# EAGLE design MA (EAGLE 9.4.2)
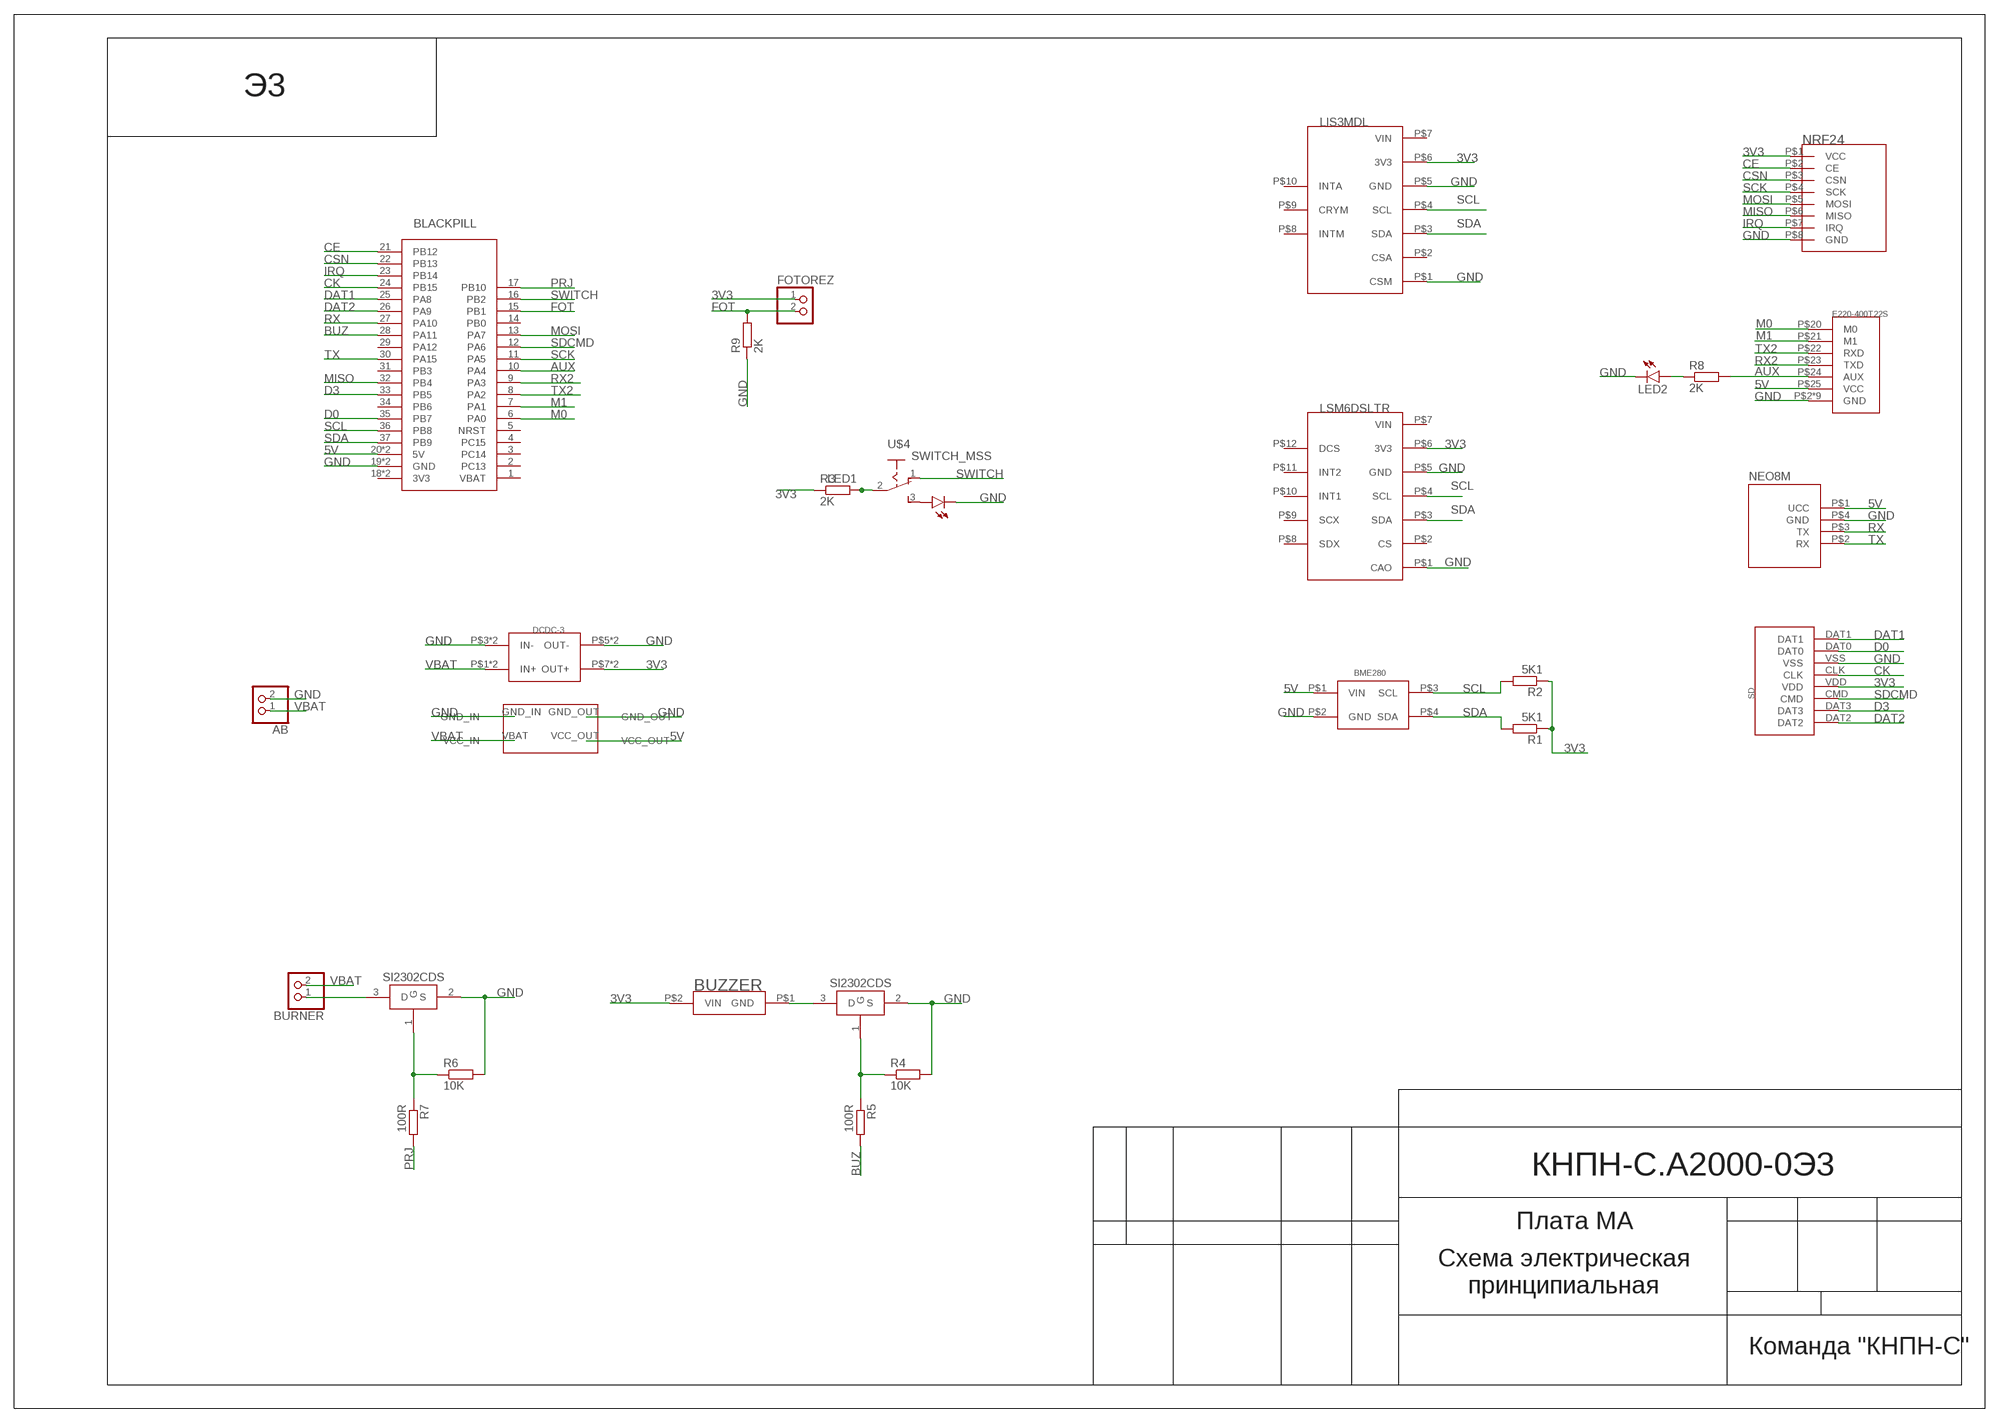
[diagram p0: schematic, sheet 1]

## Parts
AB  PINHD-1X2  [1X02]
BLACKPILL  STM32F411_BOARD  [STM32F411_BOARD]
BME280  BME280  [BME280]
BURNER  PINHD-1X2  [1X02]
BUZZER  BUZZERS8R6  [BUZZER-S8R12]
DCDC-3  MP1584-B  [MP1584-B]
E220-400T22S  E220-400T22S  [E220-400T22S]
FOTOREZ  PINHD-1X2  [1X02]
LED1  LEDCHIP-LED0603  [CHIP-LED0603]
LED2  LEDCHIP-LED0603  [CHIP-LED0603]
LIS3MDL  LIS3MDL-GY  [LIS3MDL-GY]
LSM6DSLTR  LSM6DS3-GY  [LSM6DS3-GY]
NEO8M  GPS-NEO7M  [GPS-NEO7M]
NRF24  NRF24L01_ML01SP4  [NRF24L01_ML01SP4]
R1  5K1  R-EU_R0603  [R0603]
R2  5K1  R-EU_R0603  [R0603]
R3  2K  R-EU_R0603  [R0603]
R4  10K  R-EU_R0603  [R0603]
R5  100R  R-EU_R0603  [R0603]
R6  10K  R-EU_R0603  [R0603]
R7  100R  R-EU_R0603  [R0603]
R8  2K  R-EU_R0603  [R0603]
R9  2K  R-EU_R0603  [R0603]
SD  SD  [SD]
U$1  DS-DS_5V  [DS-DS_5V]
U$2  SI2302CDS  [SOT23-3]
U$3  SI2302CDS  [SOT23-3]
U$4  SWITCH_MSS  [SWITCH_MSS]

## Nets
3V3: BUZZER.P$2(VIN) DCDC-3.P$7(OUT+) DCDC-3.P$8(OUT+) FOTOREZ.1 LIS3MDL.P$6(3V3) LSM6DSLTR.P$6(3V3) NRF24.P$1(VCC) R1.1 R2.1 R3.1 SD.VDD
5V: BLACKPILL.20(5V) BLACKPILL.38(5V) BME280.P$1(VIN) E220-400T22S.P$25(VCC) NEO8M.P$1(UCC) U$1.VCC_OUT
AUX: BLACKPILL.10(PA4) E220-400T22S.P$24(AUX) R8.2
BUZ: BLACKPILL.28(PA11) R5.2
CE: BLACKPILL.21(PB12) NRF24.P$2(CE)
CK: BLACKPILL.24(PB15) SD.CLK
CSN: BLACKPILL.22(PB13) NRF24.P$3(CSN)
D0: BLACKPILL.35(PB7) SD.DAT0
D3: BLACKPILL.33(PB5) SD.DAT3
DAT1: BLACKPILL.25(PA8) SD.DAT1
DAT2: BLACKPILL.26(PA9) SD.DAT2
FOT: BLACKPILL.15(PB1) FOTOREZ.2 R9.2
GND: AB.2 BLACKPILL.19(GND) BLACKPILL.39(GND) BME280.P$2(GND) DCDC-3.P$3(IN-) DCDC-3.P$4(IN-) DCDC-3.P$5(OUT-) DCDC-3.P$6(OUT-) E220-400T22S.P$2(GND) E220-400T22S.P$8(GND) E220-400T22S.P$11(GND) E220-400T22S.P$13(GND) E220-400T22S.P$14(GND) E220-400T22S.P$15(GND) E220-400T22S.P$16(GND) E220-400T22S.P$19(GND) E220-400T22S.P$26(GND) LED1.C LED2.C LIS3MDL.P$1(CSM) LIS3MDL.P$5(GND) LSM6DSLTR.P$1(CAO) LSM6DSLTR.P$5(GND) NEO8M.P$4(GND) NRF24.P$8(GND) R4.2 R6.2 R9.1 SD.VSS U$1.GND_IN U$1.GND_OUT U$2.2(S) U$3.2(S)
IRQ: BLACKPILL.23(PB14) NRF24.P$7(IRQ)
M0: BLACKPILL.6(PA0) E220-400T22S.P$20(M0)
M1: BLACKPILL.7(PA1) E220-400T22S.P$21(M1)
MISO: BLACKPILL.32(PB4) NRF24.P$6(MISO)
MOSI: BLACKPILL.13(PA7) NRF24.P$5(MOSI)
N$1: BUZZER.P$1(GND) U$2.3(D)
N$2: BURNER.1 U$3.3(D)
N$3: R6.1 R7.1 U$3.1(G)
N$4: R4.1 R5.1 U$2.1(G)
N$5: LED1.A U$4.3(S)
N$7: R3.2 U$4.2(P)
N$9: LED2.A R8.1
PRJ: BLACKPILL.17(PB10) R7.2
RX: BLACKPILL.27(PA10) NEO8M.P$3(TX)
RX2: BLACKPILL.9(PA3) E220-400T22S.P$23(TXD)
SCK: BLACKPILL.11(PA5) NRF24.P$4(SCK)
SCL: BLACKPILL.36(PB8) BME280.P$3(SCL) LIS3MDL.P$4(SCL) LSM6DSLTR.P$4(SCL) R2.2
SDA: BLACKPILL.37(PB9) BME280.P$4(SDA) LIS3MDL.P$3(SDA) LSM6DSLTR.P$3(SDA) R1.2
SDCMD: BLACKPILL.12(PA6) SD.CMD
SWITCH: BLACKPILL.16(PB2) U$4.1(O)
TX: BLACKPILL.30(PA15) NEO8M.P$2(RX)
TX2: BLACKPILL.8(PA2) E220-400T22S.P$22(RXD)
VBAT: AB.1 BURNER.2 DCDC-3.P$1(IN+) DCDC-3.P$2(IN+) U$1.VBAT(VCC_IN)
Unconnected: BLACKPILL.1(VBAT) BLACKPILL.2(PC13) BLACKPILL.3(PC14) BLACKPILL.4(PC15) BLACKPILL.5(NRST) BLACKPILL.14(PB0) BLACKPILL.18(3V3) BLACKPILL.29(PA12) BLACKPILL.31(PB3) BLACKPILL.34(PB6) BLACKPILL.40(3V3) LIS3MDL.P$2(CSA) LIS3MDL.P$7(VIN) LIS3MDL.P$8(INTM) LIS3MDL.P$9(CRYM) LIS3MDL.P$10(INTA) LSM6DSLTR.P$2(CS) LSM6DSLTR.P$7(VIN) LSM6DSLTR.P$8(SDX) LSM6DSLTR.P$9(SCX) LSM6DSLTR.P$10(INT1) LSM6DSLTR.P$11(INT2) LSM6DSLTR.P$12(DCS)

## Notes on the sheet
- Э3
- КНПН-С.А2000-0Э3
- Плата МА
- Схема электрическая
  принципиальная
- Команда "КНПН-С"

## Library data of the parts
AB BURNER FOTOREZ = pinhead:PINHD-1X2: PIN HEADER
BLACKPILL = MA:STM32F411_BOARD
BME280 = MA:BME280
BUZZER = MA:BUZZER
DCDC-3 = UNKNOWN-2024:MP1584-B
E220-400T22S = UNKNOWN-2024:E220-400T22S
LED1 LED2 = led:LED: LED OSRAM: - CHIPLED LG R971, LG N971, LY N971, LG Q971, LY Q971, LO R971, LY R971 LH N974, LH R974 LS Q976, LO Q976, LY Q976 LO Q996 - Hyper CHIPLED LW Q18S LB Q993, LB Q99A, LB R99A - SideLED LS A670, LO A670, LY A670, LG A670, LP A670 LB A673, LV A673, LT A673, LW A673 LH A674 LY A675 LS A676, LA A676, LO A676, LY A676, LW A676 LS A679, LY A679, LG A679 - Hyper Micro SIDELED® LS Y876, LA Y876, LO Y876, LY Y876 LT Y87S - SmartLED LW L88C, LW L88S LB L89C, LB L89S, LG L890 LS L89K, LO L89K, LY L89K LS L896, LA L896, LO L896, LY L896 - TOPLED LS T670, LO T670, LY T670, LG T670, LP T670 LSG T670, LSP T670, LSY T670, LOP T670, LYG T670 LG T671, LOG T671, LSG T671 LB T673, LV T673, LT T673, LW T673 LH T674 LS T676, LA T676, LO T676, LY T676, LB T676, LH T676, LSB T676, LW T676 LB T67C, LV T67C, LT T67C, LS T67K, LO T67K, LY T67K, LW E67C LS E67B, LA E67B, LO E67B, LY E67B, LB E67C, LV E67C, LT E67C LW T67C LS T679, LY T679, LG T679 LS T770, LO T770, LY T770, LG T770, LP T770 LB T773, LV T773, LT T773, LW T773 LH T774 LS E675, LA E675, LY E675, LS T675 LS T776, LA T776, LO T776, LY T776, LB T776 LHGB T686 LT T68C, LB T68C - Hyper Mini TOPLED® LB M676 - Mini TOPLED Santana® LG M470 LS M47K, LO M47K, LY M47K Source: http://www.osram.convergy.de LUXEON: - LUMILED® LXK2-PW12-R00, LXK2-PW12-S00, LXK2-PW14-U00, LXK2-PW14-V00 LXK2-PM12-R00, LXK2-PM12-S00, LXK2-PM14-U00 LXK2-PE12-Q00, LXK2-PE12-R00, LXK2-PE12-S00, LXK2-PE14-T00, LXK2-PE14-U00 LXK2-PB12-K00, LXK2-PB12-L00, LXK2-PB12-M00, LXK2-PB14-N00, LXK2-PB14-P00, LXK2-PB14-Q00 LXK2-PR12-L00, LXK2-PR12-M00, LXK2-PR14-Q00, LXK2-PR14-R00 LXK2-PD12-Q00, LXK2-PD12-R00, LXK2-PD12-S00 LXK2-PH12-R00, LXK2-PH12-S00 LXK2-PL12-P00, LXK2-PL12-Q00, LXK2-PL12-R00 Source: www.luxeon.com KINGBRIGHT: KA-3528ASYC Source: www.kingbright.com
LIS3MDL = MA:LIS3MDL-GY
LSM6DSLTR = MA:LSM6DS3-GY
NEO8M = MA:GPS-NEO7M
NRF24 = UNKNOWN-2024:NRF24L01_ML01SP4
R1-R9 = rcl:R-EU_: RESISTOR, European symbol; SPICEPREFIX: R
SD = UNKNOWN-2024:SD
U$1 = MA:DS-DS_5V
U$2 U$3 = CanCubeSat:SI2302CDS
U$4 = UNKNOWN-2024:SWITCH_MSS

## Board
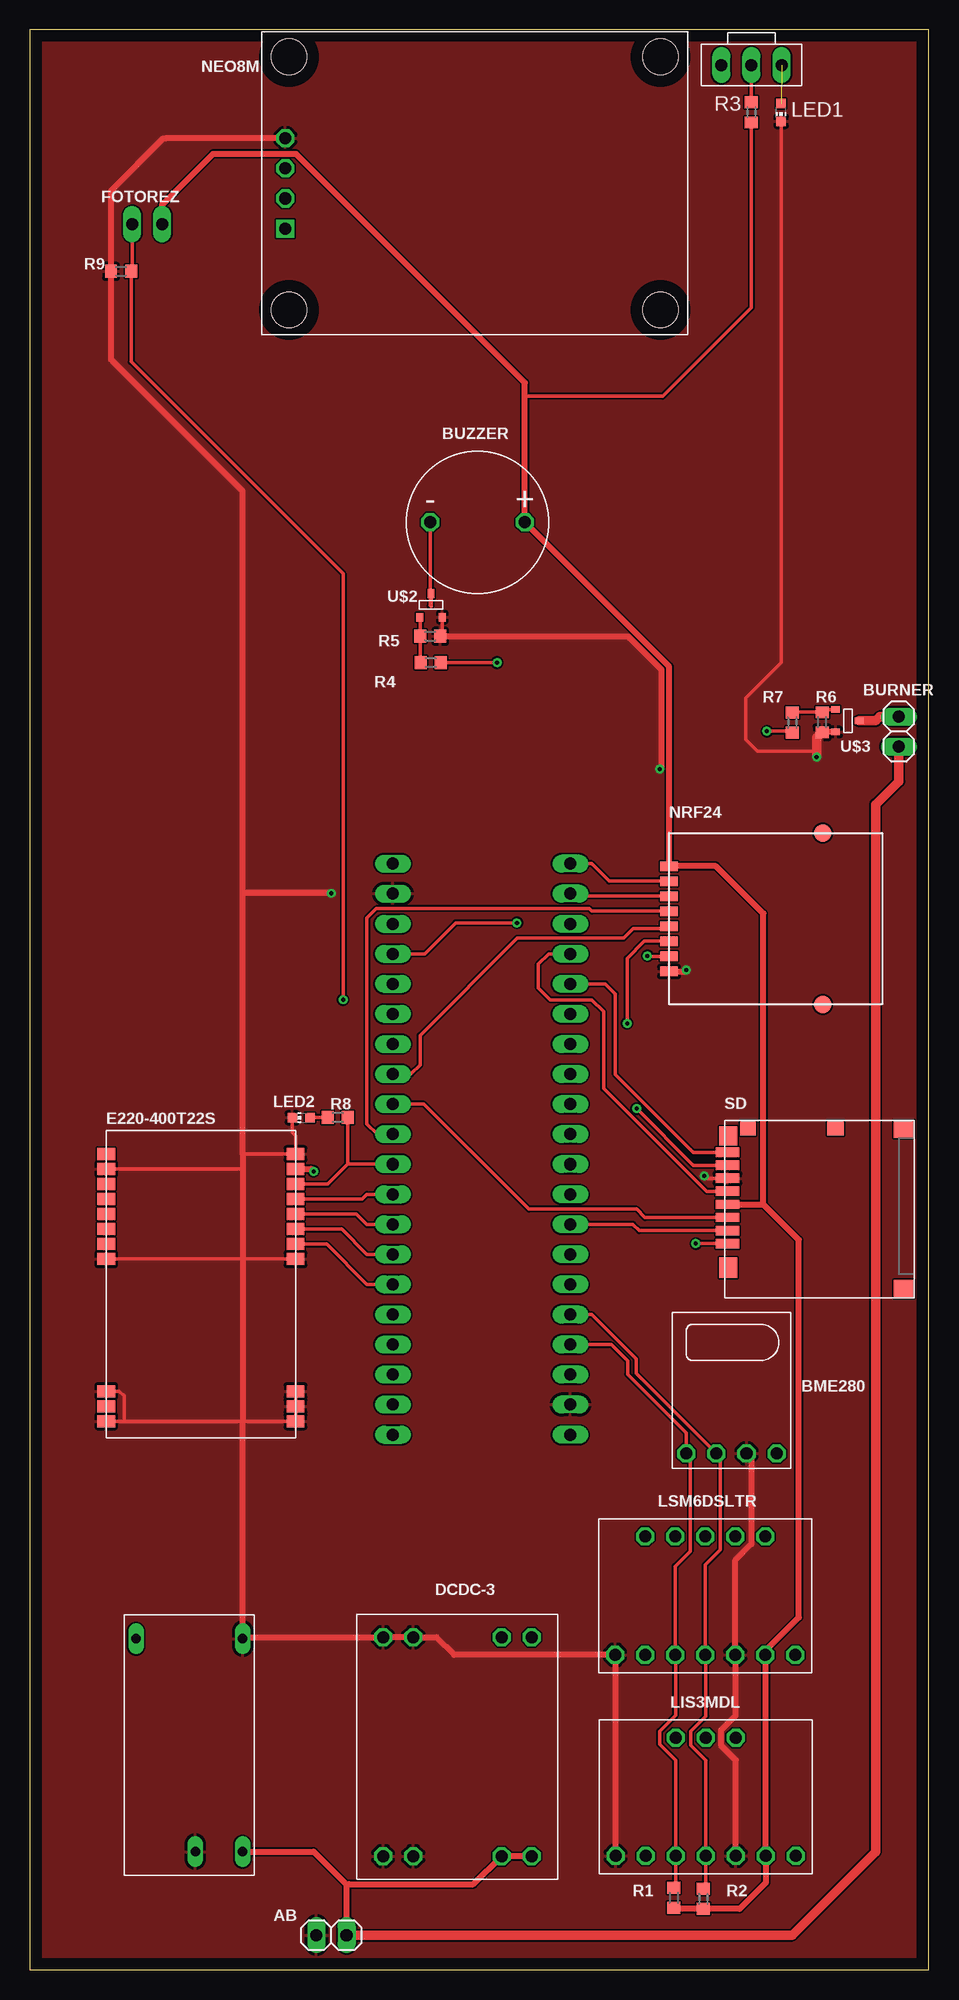
[diagram p1: board, top side]
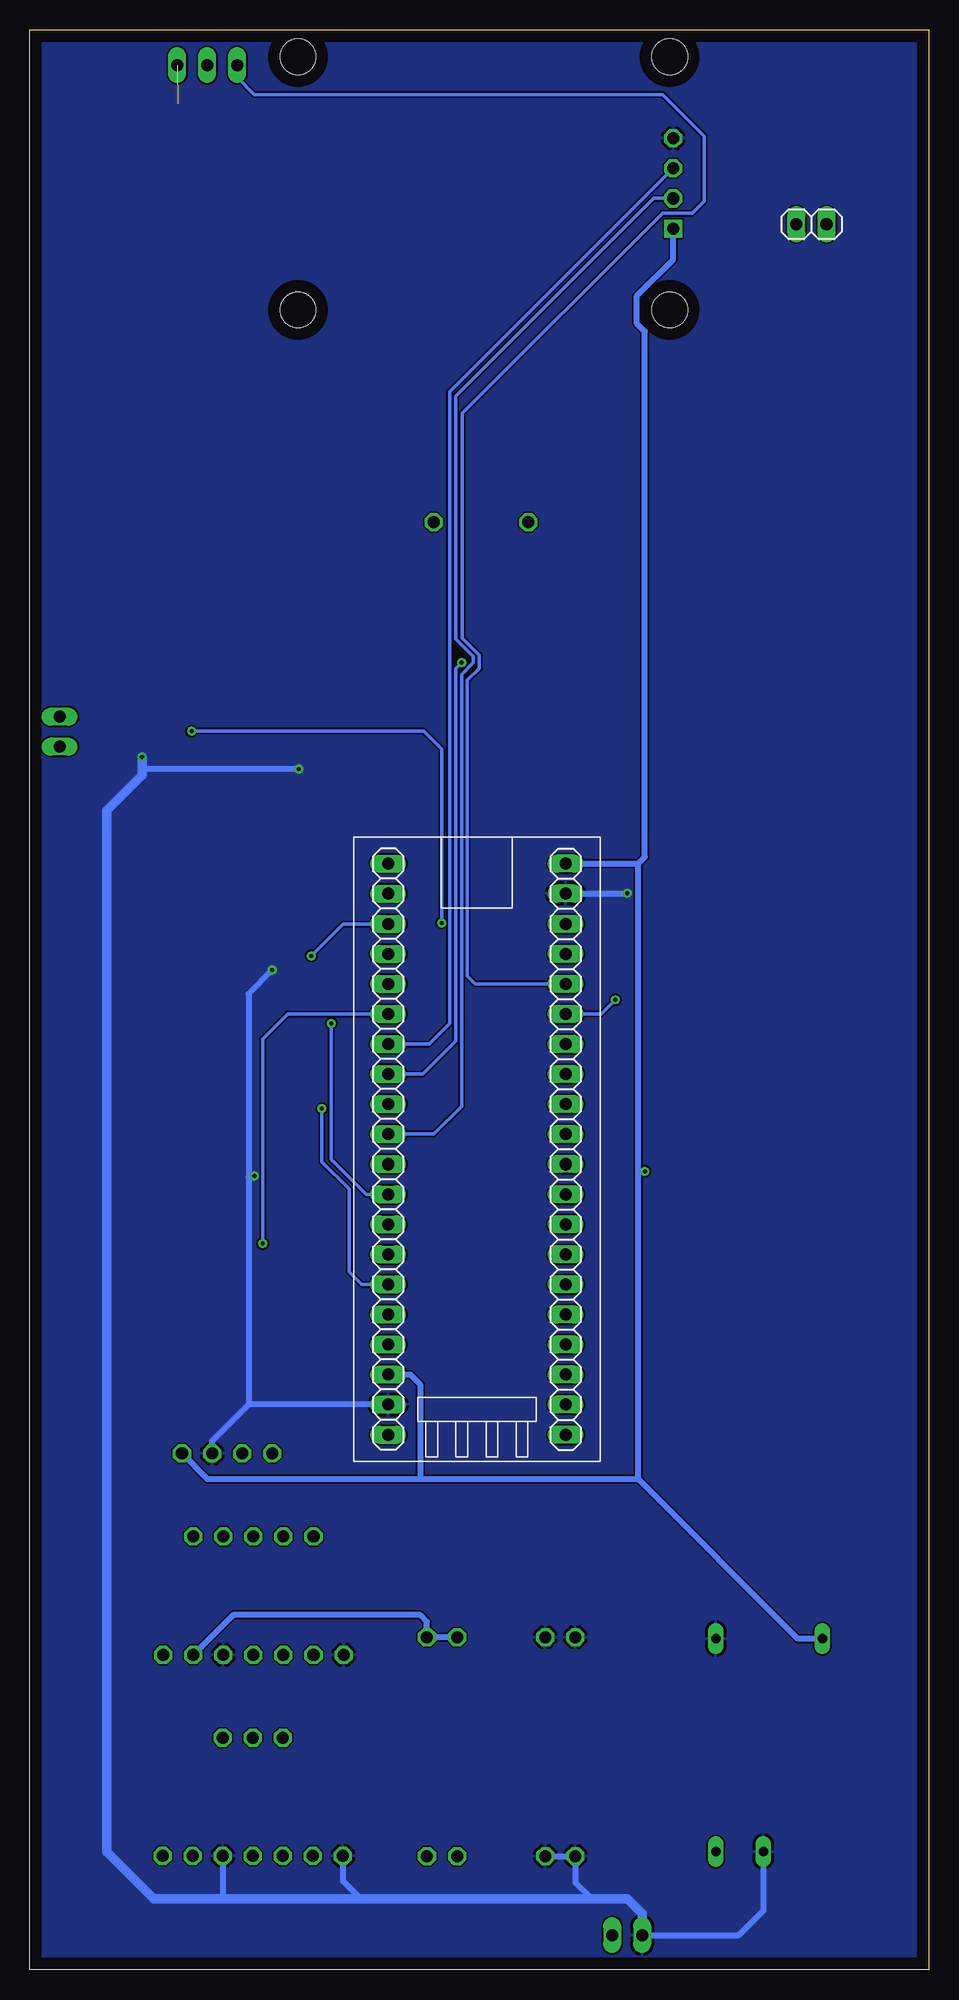
[diagram p2: board, bottom side, seen from below]

Size 76 x 164 mm. Coordinates in mm from the lower left corner, seen from the top.
Outline: 0,0 76,0 76,164 0,164 0,0
Copper layers (1*16): Top 0.035mm / dielectric 1.5mm / Bottom 0.035mm
Design rules "default": minimum track width 6mil, minimum drill 0.35mm, track to track 6mil, track to pad 6mil, pad to pad 6mil, via to via 6mil, smd to smd 6mil, copper to edge 40mil, drill to drill 6mil, minimum pad ring 10mil, minimum via ring 8mil, stop-mask expansion 4mil, vias tented up to drill 0mil, thermal gap 10mil

### Footprints (pad centres in the part's own frame; a part is rotated, then mirrored left to right if it is on the bottom)
1X02 = drill 1.016 long: 1 -1.27,0; 2 1.27,0
STM32F411_BOARD = drill 1.016 long: 1 24.13,7.5; 2 21.59,7.5; 3 19.05,7.5; 4 16.51,7.5; 5 13.97,7.5; 6 11.43,7.5; 7 8.89,7.5; 8 6.35,7.5; 9 3.81,7.5; 10 1.27,7.5; 11 -1.27,7.5; 12 -3.81,7.5; 13 -6.35,7.5; 14 -8.89,7.5; 15 -11.43,7.5; 16 -13.97,7.5; 17 -16.51,7.5; 18 -19.05,7.5; 19 -21.59,7.5; 20 -24.13,7.5; 21 -24.13,-7.5; 22 -21.59,-7.5; 23 -19.05,-7.5; 24 -16.51,-7.5; 25 -13.97,-7.5; 26 -11.43,-7.5; 27 -8.89,-7.5; 28 -6.35,-7.5; 29 -3.81,-7.5; 30 -1.27,-7.5; 31 1.27,-7.5; 32 3.81,-7.5; 33 6.35,-7.5; 34 8.89,-7.5; 35 11.43,-7.5; 36 13.97,-7.5; 37 16.51,-7.5; 38 19.05,-7.5; 39 21.59,-7.5; 40 24.13,-7.5
BME280 = drill 1.016 octagon: P$1 -3.81,5.33; P$2 -1.27,5.33; P$3 1.27,5.33; P$4 3.81,5.33
BUZZER-S8R12 = drill 1 octagon: P$1 -4,0; P$2 4,0
MP1584-B = drill 1.016 octagon: P$1 -9.25,-6.27; P$2 -9.25,-3.73; P$3 -9.25,3.73; P$4 -9.25,6.27; P$5 9.25,6.27; P$6 9.25,3.73; P$7 9.25,-3.73; P$8 9.25,-6.27
E220-400T22S = smd 1.5 x 1: P$1 -8,11; P$2 -8,9.73; P$3 -8,8.46; P$4 -8,7.19; P$5 -8,5.92; P$6 -8,4.65; P$7 -8,3.38; P$8 -8,2.11; P$11 -8,-9.06; P$12 -8,-10.33; P$13 -8,-11.6; P$14 8,-11.6; P$15 8,-10.33; P$16 8,-9.06; P$19 8,2.11; P$20 8,3.38; P$21 8,4.65; P$22 8,5.92; P$23 8,7.19; P$24 8,8.46; P$25 8,9.73; P$26 8,11
CHIP-LED0603 = smd 0.8 x 0.8: A 0,-0.75; C 0,0.75
LIS3MDL-GY = drill 1.016 octagon: P$1 -7.62,-5; P$2 -5.08,-5; P$3 -2.54,-5; P$4 0,-5; P$5 2.54,-5; P$6 5.08,-5; P$7 7.62,-5; P$8 -2.54,5; P$9 0,5; P$10 2.54,5
LSM6DS3-GY = drill 1.016 octagon: P$1 -7.62,-5; P$2 -5.08,-5; P$3 -2.54,-5; P$4 0,-5; P$5 2.54,-5; P$6 5.08,-5; P$7 7.62,-5; P$8 -5.08,5; P$9 -2.54,5; P$10 0,5; P$11 2.54,5; P$12 5.08,5
GPS-NEO7M = drill 1.016 square: P$1 -3.81,16 | drill 1.016 octagon: P$2 -1.27,16; P$3 1.27,16; P$4 3.81,16 | hole 3: -10.7,15.7; 10.7,15.7; 10.7,-15.7; -10.7,-15.7
NRF24L01_ML01SP4 = smd 1.5 x 0.8: P$1 -9,4.445; P$2 -9,3.175; P$3 -9,1.905; P$4 -9,0.635; P$5 -9,-0.635; P$6 -9,-1.905; P$7 -9,-3.175; P$8 -9,-4.445 | smd 1.5 x 1.5: P$9 4,7.25; P$10 4,-7.25
R0603 = smd 1 x 1.1: 1 -0.85,0; 2 0.85,0
SD = smd 0.8 x 2: CLK 6,-15.77; CMD 8.2,-15.77; DAT0 3.8,-15.77; DAT1 2.7,-15.77; DAT2 10.4,-15.77; DAT3 9.3,-15.77; VDD 7.1,-15.77; VSS 4.9,-15.77 | smd 1.5 x 1.7: P$9 0.75,-0.85; P$13 14.25,-0.85 | smd 1.6 x 1.5: P$10 1.3,-15.7 | smd 1.29 x 1.3: P$11 0.645,-14.05 | smd 1.29 x 1.4: P$12 0.645,-6.65 | smd 1.7 x 1.5: P$14 12.45,-15.7
DS-DS_5V = drill 0.8 long: GND_IN 0,-13; GND_OUT 4,5; VBAT 4,-13; VCC_OUT -5,5
SOT23-3 = smd 0.56 x 0.73: 1 -0.95,-1; 2 0.95,-1; 3 0,1
SWITCH_MSS = drill 1.016 long: 1 -2.54,0; 2 0,0; 3 2.54,0

### Placement (x,y rotation side)
AB  25.51,2.94 180 top
BLACKPILL  38.2,69.37 270 bottom
BME280  59.31,48.97 180 top
BURNER  73.46,104.66 270 top
BUZZER  37.85,122.36 0 top
DCDC-3  36.15,18.87 90 top
E220-400T22S  14.47,57.97 0 top
FOTOREZ  9.93,147.55 0 bottom
LED1  63.5,157 180 top
LED2  22.95,72.03 90 top
LIS3MDL  57.14,14.63 0 top
LSM6DSLTR  57.09,31.63 0 top
NEO8M  37.61,151 90 top
NRF24  63.04,88.85 0 top
R1  54.44,6.09 90 top
R2  56.94,6.01 90 top
R3  61,157 90 top
R4  33.86,112.73 0 top
R5  33.9,110.5 0 top
R6  66.96,105.45 270 top
R7  64.46,105.43 270 top
R8  26.04,72.06 0 top
R9  7.73,143.56 0 top
SD  74.74,71.8 270 top
U$1  14,23 0 top
U$2  33.92,115.33 0 top
U$3  69.1,105.59 270 top
U$4  61,161 0 top

### Tracks (layer width: path | path; a pad name or v marks a point on that pad's centre or on a via)
3V3
  Top 0.3: 57,5.16 R2.1 | LSM6DSLTR.P$6 62.22,26.58 62.22,27 | 54.52,5.16 R1.1 | 54.5,93.3 NRF24.P$1 | R3.1 61,140.5 53.5,133 41.85,133
  Top 0.5: 62.22,26.58 LIS3MDL.P$6 62.22,7.38 60,5.16 57,5.16 | 62.22,27 65,29.78 65,61.7 62,64.7 | SD.VDD 62,64.7 | 54.5,93.3 58,93.3 62,89.3 62,64.7 | R2.1 54.52,5.16 | NRF24.P$1 54.04,110.17 BUZZER.P$2 41.85,133 41.85,134.15 22.5,153.5 15.5,153.5 11.2,149.2 FOTOREZ.1
  Bottom 0.5: LSM6DSLTR.P$6 58.8,30 43,30 42.42,29.42 DCDC-3.P$8 DCDC-3.P$7
5V  (via drill 0.35)
  Top 0.5: E220-400T22S.P$25 23.8,67.7 v24,67.5
  Bottom 0.3: 24.54,41.46 24.58,41.5
  Bottom 0.5: U$1.VCC_OUT 11.08,28 24.54,41.46 | BME280.P$1 60.98,41.5 43,41.5 | 43,41.5 24.58,41.5 24.58,67.5 | v24,67.5 24.58,67.5 | 24.58,67.5 24.58,93.5 | BLACKPILL.20 24.58,93.5 | 24.58,93.5 24.01,94.07 24.01,138.49 24.68,139.15 24.68,141.5 21.61,144.57 NEO8M.P$1 | BLACKPILL.38 43.82,50.32 43,49.5 43,41.5
AUX
  Top 0.3: E220-400T22S.P$24 25.2,66.43 26.87,68.1 26.9,68.1 | R8.2 26.89,68.11 26.9,68.1 | BLACKPILL.10 26.9,68.1
BUZ  (via drill 0.35)
  Top 0.3: R5.2 v39.5,110.5
  Bottom 0.3: BLACKPILL.28 42.78,75.72 40,78.5 40,110 v39.5,110.5
CE
  Top 0.3: NRF24.P$2 48.98,92.03 47.5,93.5 BLACKPILL.21
CK
  Top 0.3: BLACKPILL.24 43.88,85.88 43,85 43,83 44,82 47.5,82 48.5,81 48.5,74.5 57.2,65.8 SD.CLK
CSN
  Top 0.3: BLACKPILL.22 45.74,91 45.98,90.75 NRF24.P$3
D0  (via drill 0.35)
  Top 0.3: SD.DAT0 56.1,68 v51.3,72.8
  Bottom 0.3: v51.3,72.8 51.3,68.3 49,66 49,59 47.94,57.94 BLACKPILL.35
D3
  Top 0.3: SD.DAT3 51.5,62.5 50.98,63.02 BLACKPILL.33
DAT1
  Top 0.3: SD.DAT1 56.1,69.1 49.5,75.7 49.5,82.5 48.66,83.34 BLACKPILL.25
DAT2  (via drill 0.35)
  Top 0.3: SD.DAT2 v56.3,61.4
  Bottom 0.3: v56.3,61.4 56.3,78.7 54.2,80.8 BLACKPILL.26
FOT  (via drill 0.35)
  Top 0.3: R9.2 8.58,143.5 | 8.58,143.5 8.58,135.92 26.5,118 v26.5,82 | FOTOREZ.2 8.66,143.58 8.58,143.5
  Bottom 0.3: v26.5,82 27.7,80.8 BLACKPILL.15
GND  (via drill 0.35)
  Top 0.3: LED2.C 22.2,70.8 22.5,70.5 22.5,69 E220-400T22S.P$26 18.03,68.97 18,69 | 11.31,154.81 11.5,154.81 | 6.88,144 R9.1 6.88,143 | 7,136 6.88,136.12 | E220-400T22S.P$13 8,46.37 | 8,46.37 17.93,46.37 | 17.93,46.37 18,46.3 | 17.93,46.37 E220-400T22S.P$14 E220-400T22S.P$15 E220-400T22S.P$16 | E220-400T22S.P$19 18.02,60.08 18,60.1 17.98,60.08 E220-400T22S.P$8 | E220-400T22S.P$2 18,67.7 | U$2.2 34.87,112.9 R4.2 | SD.VSS 57.2,66.9 v57,67.1 | 8,46.37 8,48.5 7.59,48.91 E220-400T22S.P$11 | LED1.C 63.5,110.5 60.5,107.5 60.5,104 61.5,103 66.5,103
  Top 0.5: U$3.2 67,104.64 R6.2 | LIS3MDL.P$5 59.68,17.74 58.42,19 58.42,20.27 59.63,21.48 LSM6DSLTR.P$5 59.63,34.64 60.99,36 60.99,43.23 BME280.P$2 | LIS3MDL.P$1 49.47,9.68 LSM6DSLTR.P$1 35.87,26.63 34.38,28.12 DCDC-3.P$6 DCDC-3.P$5 18,28.12 | U$1.GND_OUT 18,28.12 | 18,28.12 18,46.3 18,60.1 18,67.7 18,69 18,91 | 18,91 18,125 7,136 | 6.88,136.12 6.88,143 | 6.88,144 6.88,150.38 11.31,154.81 | NEO8M.P$4 11.5,154.81 | NRF24.P$8 55.41,84.41 v55.5,84.5 | R4.2 50.55,112.73 53.39,109.9 53.39,101.63 v53.26,101.5 | v25.5,91 18,91
  Top 0.8: v66.5,102.5 66.5,103 66.5,104.14 67,104.64
  Bottom 0.5: LIS3MDL.P$1 49.52,7.52 48,6 | LIS3MDL.P$5 59.68,6.18 59.5,6 | AB.2 16.06,2.94 14,5 U$1.GND_IN | BME280.P$2 60.58,44.7 57.5,47.78 | BLACKPILL.39 57.5,47.78 | v55.5,84.5 57.5,82.5 57.5,67 | v57,67.1 57.1,67 57.5,67 | 57.5,67 57.5,47.78 | DCDC-3.P$3 DCDC-3.P$4 29.88,7.38 28.5,6 | v53.26,101.5 66.5,101.5 | BLACKPILL.19 25.54,90.96 v25.5,91
  Bottom 0.8: AB.2 24.24,4.74 25.5,6 28.5,6 48,6 59.5,6 65.5,6 69.5,10 69.5,98 66.5,101 66.5,101.5 v66.5,102.5
  pour Bottom: -1,165 -1,-1 77,-1 77,165
  pour Top: -1,165 -1,-1 77,-1 77,165
IRQ  (via drill 0.35)
  Top 0.3: NRF24.P$7 52.23,85.67 v52.2,85.7
  Bottom 0.3: v52.2,85.7 49.48,88.42 BLACKPILL.23
M0
  Top 0.3: BLACKPILL.6 28.5,57.94 25.09,61.35 E220-400T22S.P$20
M1
  Top 0.3: BLACKPILL.7 28.5,60.48 26.36,62.62 E220-400T22S.P$21
MISO  (via drill 0.35)
  Top 0.3: v50.5,80 50.5,85.5 51.95,86.94 NRF24.P$6
  Bottom 0.3: BLACKPILL.32 47.56,65.56 50.5,68.5 v50.5,80
MOSI
  Top 0.3: NRF24.P$5 53.83,88 51,88 50.2,87.2 41.2,87.2 33,79 33,76.5 32.22,75.72 BLACKPILL.13
N$1
  Top 0.3: BUZZER.P$1 33.85,115.31 33.92,115.24 U$2.3
N$2
  Top 0.8: BURNER.1 71.84,105.93 71.5,105.59 U$3.3
N$3
  Top 0.3: U$3.1 67.2,106.54 R6.1 64.48,106.3 R7.1
N$4
  Top 0.3: U$2.1 33.01,114.29 R4.1 33.01,110.54 R5.1
N$5  (1 unrouted)
N$7
  Top 0.3: U$4.2 R3.2
N$9
  Top 0.3: R8.1 25.16,72.03 LED2.A
PRJ  (via drill 0.35)
  Top 0.3: v41.18,88.5 36,88.5 33.38,85.88 BLACKPILL.17 | v62.3,104.7 64.34,104.7 R7.2
  Bottom 0.3: v41.18,88.5 41.18,103.18 42.7,104.7 v62.3,104.7
RX
  Bottom 0.3: BLACKPILL.27 42.24,78.26 40.5,80 40.5,133.38 NEO8M.P$3
RX2
  Top 0.3: BLACKPILL.9 28.5,65.56 28.1,65.16 E220-400T22S.P$23
SCK
  Top 0.3: BLACKPILL.11 29.36,70.64 28.5,71.5 28.5,88.9 29.3,89.7 47.3,89.7 47.51,89.48 NRF24.P$4
SCL
  Top 0.3: R2.2 57.14,7.06 LIS3MDL.P$4 57.14,17.73 55.88,18.99 55.88,20.17 57.14,21.43 57.14,26.58 LSM6DSLTR.P$4 57.09,34.23 58.35,35.49 58.35,43.33 BME280.P$3 51.26,50.42 51.26,51.64 47.5,55.4 BLACKPILL.36
SDA
  Top 0.3: R1.2 54.6,7.1 LIS3MDL.P$3 54.6,17.73 53.24,19.09 53.24,20.17 54.6,21.54 54.6,26.58 LSM6DSLTR.P$3 54.55,34.12 55.81,35.39 55.81,43.33 BME280.P$4 55.5,45.38 50.54,50.34 50.54,51.46 49.14,52.86 BLACKPILL.37
SDCMD
  Top 0.3: SD.CMD 52,63.6 51.3,64.3 42.2,64.3 33.32,73.18 BLACKPILL.12
SWITCH
  Bottom 0.3: BLACKPILL.16 38.34,83.34 39,84 39,109 38,110 38,111.14 39.43,112.57 39.43,131.57 22.5,148.5 20,148.5 19,149.5 19,155 22.5,158.5 57,158.5 58.46,159.96 U$4.1
TX
  Bottom 0.3: BLACKPILL.30 41.86,70.64 39.5,73 39.5,109.5 38.5,110.5 38.5,111 40,112.5 40,133 23.27,149.73 NEO8M.P$2
TX2
  Top 0.3: BLACKPILL.8 30.68,63 28.5,63 27.61,63.89 E220-400T22S.P$22
VBAT
  Top 0.3: 26.78,7.22 26.75,7.25 27,7.25
  Top 0.5: AB.1 26.78,7.22 | U$1.VBAT 24,10 26.75,7.25 | DCDC-3.P$1 DCDC-3.P$2 37.51,7.25 27,7.25
  Top 0.8: AB.1 64.44,2.94 71.5,10 71.5,98.5 73.46,100.46 BURNER.2